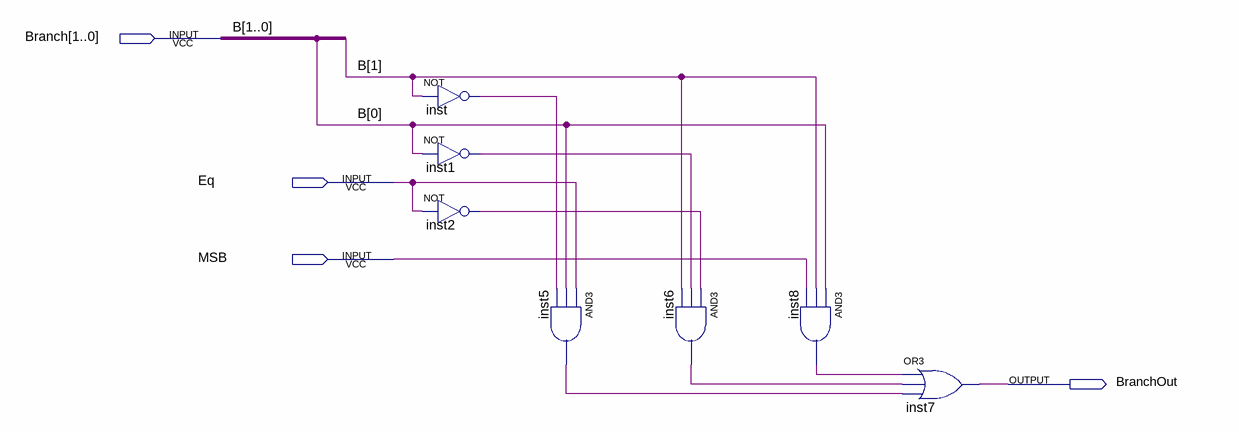
[diagram p0: schematic sheet]
// Quartus schematic BranchControl.bdf as structural Verilog: 7 symbols, 4 pins
module BranchControl (
  input  [1:0] Branch,
  input  Eq,
  input  MSB,
  output BranchOut
);

  wire inst1_out, inst2_out, inst5_out, inst6_out, inst8_out, inst_out;

  not inst (inst_out, Branch[1]);
  not inst1 (inst1_out, Branch[0]);
  not inst2 (inst2_out, Eq);
  and inst5 (inst5_out, Eq, Branch[0], inst_out);
  and inst6 (inst6_out, inst2_out, inst1_out, Branch[1]);
  and inst8 (inst8_out, Branch[0], Branch[1], MSB);
  or inst7 (BranchOut, inst8_out, inst6_out, inst5_out);

  // Other names for the same wires on the sheet: B[1:0] = Branch
endmodule
